# EAGLE design db9_trs_adapter (EAGLE 6.4)
DATABASE: ./../../dossant-PARTSDB.txt
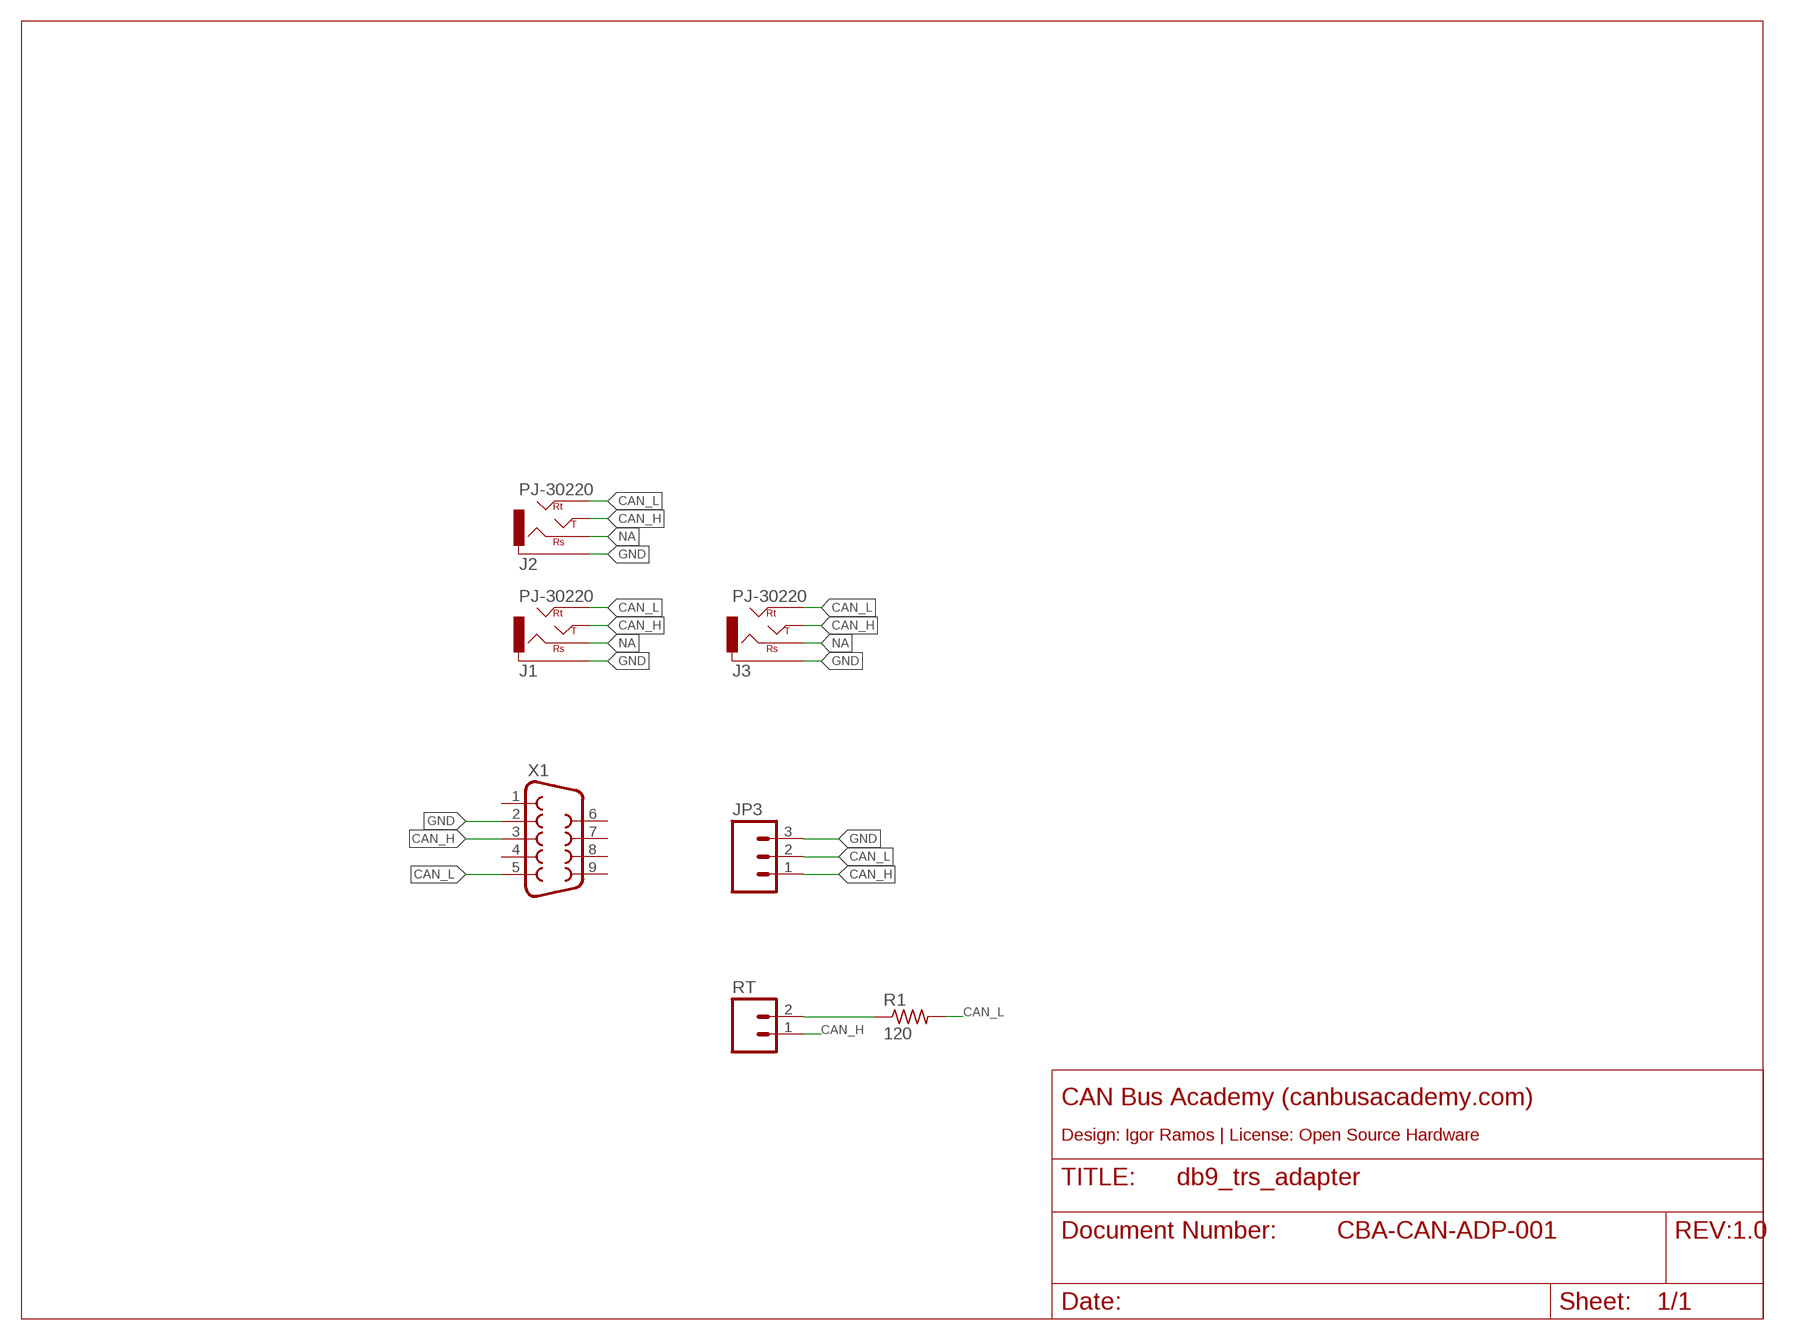
[diagram p0: schematic, sheet 1]

## Parts
J1  PJ-30220  AUDIO_JACK_4POSA  [PJ-30220]
J2  PJ-30220  AUDIO_JACK_4POSA  [PJ-30220]
J3  PJ-30220  AUDIO_JACK_4POSA  [PJ-30220]
JP3  M03PTH  [1X03]
R1  120  R-US_M0805  [M0805]
RT  M02PTH  [1X02]
X1  DB9FEMALE  [DB9]

## Nets
CAN_H: J1.P$03(TIP) J1.P$03B(TIP) J2.P$03(TIP) J2.P$03B(TIP) J3.P$03(TIP) J3.P$03B(TIP) JP3.1 RT.1 X1.3
CAN_L: J1.P$04(RT) J2.P$04(RT) J3.P$04(RT) JP3.2 R1.2 X1.5
GND: J1.P$01(SLEEVE) J2.P$01(SLEEVE) J3.P$01(SLEEVE) JP3.3 X1.2
N$4: R1.1 RT.2
NA: J1.P$02(RS) J2.P$02(RS) J3.P$02(RS)
Unconnected: X1.1 X1.4 X1.6 X1.7 X1.8 X1.9

## Notes on the sheet
- CAN Bus Academy (canbusacademy.com)
- Design: Igor Ramos | License: Open Source Hardware
- CBA-CAN-ADP-001 | 1.0

## Library data of the parts
J1-J3 = igor_lib_6d4d0:AUDIO_JACK_4POS: updated as of 5/4/2013. v1: initial v2: swapped tip and rt based on bad cable, reduced hole diam. v3: swapped RS and RT and added tName pinout; PARTNO: PJ30220
JP3 = SparkFun:M03: Header 3 Standard 3-pin 0.1" header. Use with straight break away headers (SKU : PRT-00116), right angle break away headers (PRT-00553), swiss pins (PRT-00743), machine pins (PRT-00117), and female headers (PRT-00115). Molex polarized connector foot print use with SKU : PRT-08232 with associated crimp pins and housings.
R1 = rcl:R-US_: RESISTOR, American symbol
RT = SparkFun:M02: Header 2 Standard 2-pin 0.1" header. Use with straight break away headers (SKU : PRT-00116), right angle break away headers (PRT-00553), swiss pins (PRT-00743), machine pins (PRT-00117), and female headers (PRT-00115). Molex polarized connector foot print use with SKU : PRT-08233 with associated crimp pins and housings.
X1 = SparkFun:DB9: DB9 Connector Standard DB9 (D-Sub 9) serial connector. Can be used for CAN bus as well as RS485 and RS232. Footprint production proven. Spark Fun Electronics SKU : PRT-00429

## Board
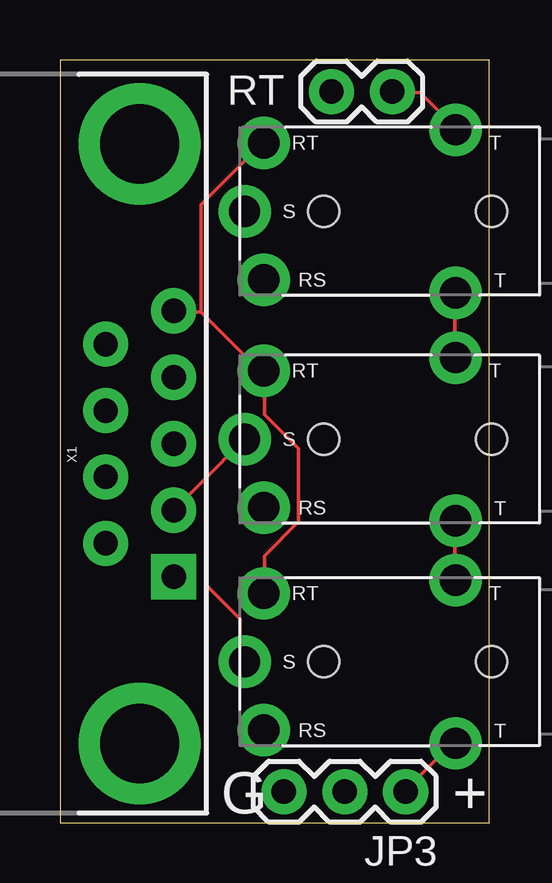
[diagram p1: board, top side]
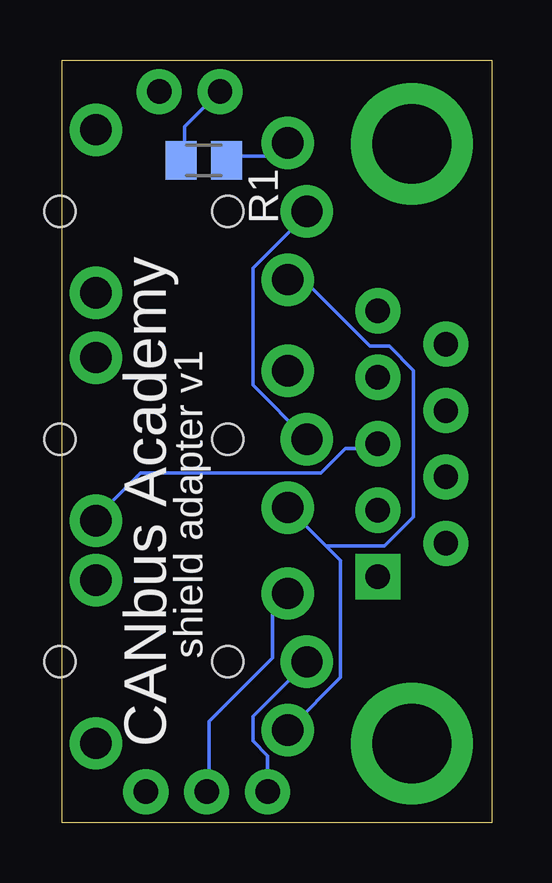
[diagram p2: board, bottom side, seen from below]

Size 17.91 x 31.79 mm. Coordinates in mm from the lower left corner, seen from the top.
Outline: 0,0 17.91,0 17.91,31.79 0,31.79 0,0
Copper layers (1*16): Top 0.0356mm / dielectric 1.5011mm / Bottom 0.0356mm
Design rules "LaenPCBOrder_RECAP_20pc_restring": minimum track width 6mil, minimum drill 13mil, track to track 6mil, track to pad 6mil, pad to pad 6mil, via to via 6mil, smd to smd 6mil, copper to edge 15mil, drill to drill 6mil, minimum pad ring 7mil, minimum via ring 7mil, stop-mask expansion 4mil, vias tented up to drill 0mil, thermal gap 10mil
vRestrict: area 3.6,1.4 to 6.6,2.2; area 14.8,8.1 to 16.2,9.4; area 16.4,6.2 to 17.2,7.1; area 18.8,6.1 to 19.8,7.2; area 17.4,4.2 to 18.6,5.3; area 0.6,7.5 to 1.9,8.7; area 11,10.5 to 12,11.4; area 1.2,0.3 to 9.2,2.2; 2 lines

### Footprints (pad centres in the part's own frame; a part is rotated, then mirrored left to right if it is on the bottom)
PJ-30220 = drill 1.3 pad 2.184: P$01 12.3,0; P$02 11.5,2.85; P$03 3.5,-3.4; P$03B 3.5,3.4; P$04 11.5,-2.85 | hole 1.3: 2,0; 9,0
1X03 = drill 1.016 pad 1.88: 1 0,0; 2 2.54,0; 3 5.08,0
M0805 = smd 1.3 x 1.6: 1 -0.95,0; 2 0.95,0
1X02 = drill 1.016 pad 1.88: 1 0,0; 2 2.54,0
DB9 = drill 1.016 pad 1.88 square: 1 -5.54,-1.42 | drill 1.016 pad 1.88: 2 -2.77,-1.42; 3 0,-1.42; 4 2.77,-1.42; 5 5.54,-1.42; 6 -4.15,1.42; 7 -1.38,1.42; 8 1.38,1.42; 9 4.15,1.42 | drill 3.302 pad 5.08: G1 -12.5,0; G2 12.5,0

### Placement (x,y rotation side)
J1  20,25.48 180 top
J2  20,6.7 180 top
J3  20,15.98 180 top
JP3  14.42,1.29 180 top
R1  60  [M0805]  12,27.61 0 bottom
RT  13.86,30.48 180 top
X1  3.32,15.79 90 top

### Tracks (layer width: path | path; a pad name or v marks a point on that pad's centre or on a via)
CAN_H
  Top 0.152: RT.1 14.02,30.43 15.04,30.43 16.46,29.01 J1.P$03 | JP3.1 14.43,1.37 16.46,3.4 J2.P$03B | J2.P$03 16.46,10.11 16.46,12.55 J3.P$03B | J1.P$03B 16.46,21.89 16.46,19.46 J3.P$03
  Bottom 0.152: X1.3 4.88,15.6 6.1,15.6 7.11,14.58 14.63,14.58 16.46,12.75 J3.P$03B
CAN_L
  Top 0.152: 5.89,21.29 4.88,21.29 X1.5 | 5.89,21.29 8.33,18.85 J3.P$04 8.53,18.64 8.53,17.02 9.96,15.6 9.96,12.55 8.53,11.12 8.53,9.7 J2.P$04 | 5.89,21.29 5.89,25.76 8.33,28.19 J1.P$04
  Bottom 0.152: JP3.2 11.79,1.37 11.79,4.22 9.14,6.86 9.14,8.89 8.53,9.5 J2.P$04 | R1.2 10.97,27.79 8.94,27.79 8.53,28.19 J1.P$04
GND
  Top 0.152: 6.1,14.38 7.52,15.8 J3.P$01 | 6.1,14.38 4.88,13.16 X1.2 | 6.1,14.38 6.1,9.91 7.52,8.48 7.52,6.86 J2.P$01
  Bottom 0.152: JP3.3 9.35,1.37 9.35,2.79 9.96,3.4 9.96,4.42 7.72,6.65 J2.P$01 | J1.P$01 7.72,25.35 9.96,23.11 9.96,18.24 7.72,16 J3.P$01
N$4
  Bottom 0.152: R1.1 12.8,27.79 12.8,29.01 11.38,30.43 RT.2
NA
  Bottom 0.152: 6.91,11.53 8.33,12.95 J3.P$02 | 6.91,11.53 6.3,10.92 6.3,6.04 8.33,4.01 J2.P$02 | 6.91,11.53 4.47,11.53 3.25,12.75 3.25,18.85 4.27,19.86 5.08,19.86 7.72,22.5 8.33,22.5 J1.P$02

### Text on the board
tNames: G | +
bNames: shield adapter v1 | CANbus Academy